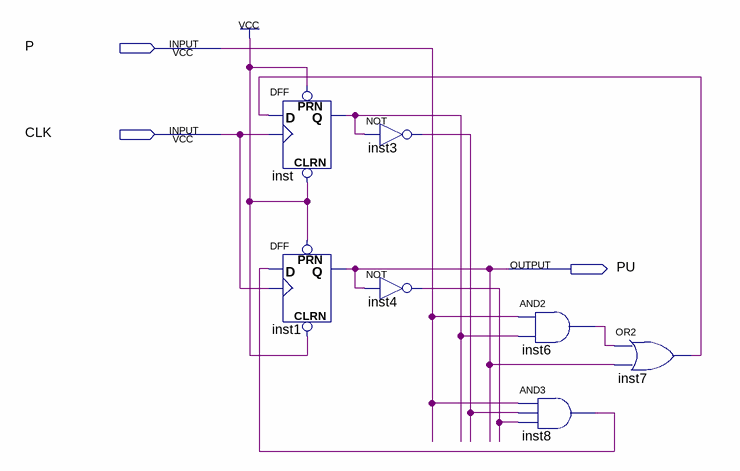
[diagram p0: schematic sheet]
// Quartus schematic mod_PU.bdf as structural Verilog: 7 symbols, 3 pins
module mod_PU (
  input  P,
  input  CLK,
  output PU
);

  wire inst3_out, inst4_out, inst6_out, inst7_out, inst8_out, inst_q;

  DFF inst (.CLRN(1'b1), .CLK(CLK), .D(inst7_out), .PRN(1'b1), .Q(inst_q));
  DFF inst1 (.CLRN(1'b1), .CLK(CLK), .D(inst8_out), .PRN(1'b1), .Q(PU));
  not inst3 (inst3_out, inst_q);
  not inst4 (inst4_out, PU);
  and inst6 (inst6_out, P, inst_q);
  and inst8 (inst8_out, P, inst3_out, inst4_out);
  or inst7 (inst7_out, inst6_out, PU);
endmodule
